# Altium schematic sheet Pan and Tilt Controller.SchDoc
size A4
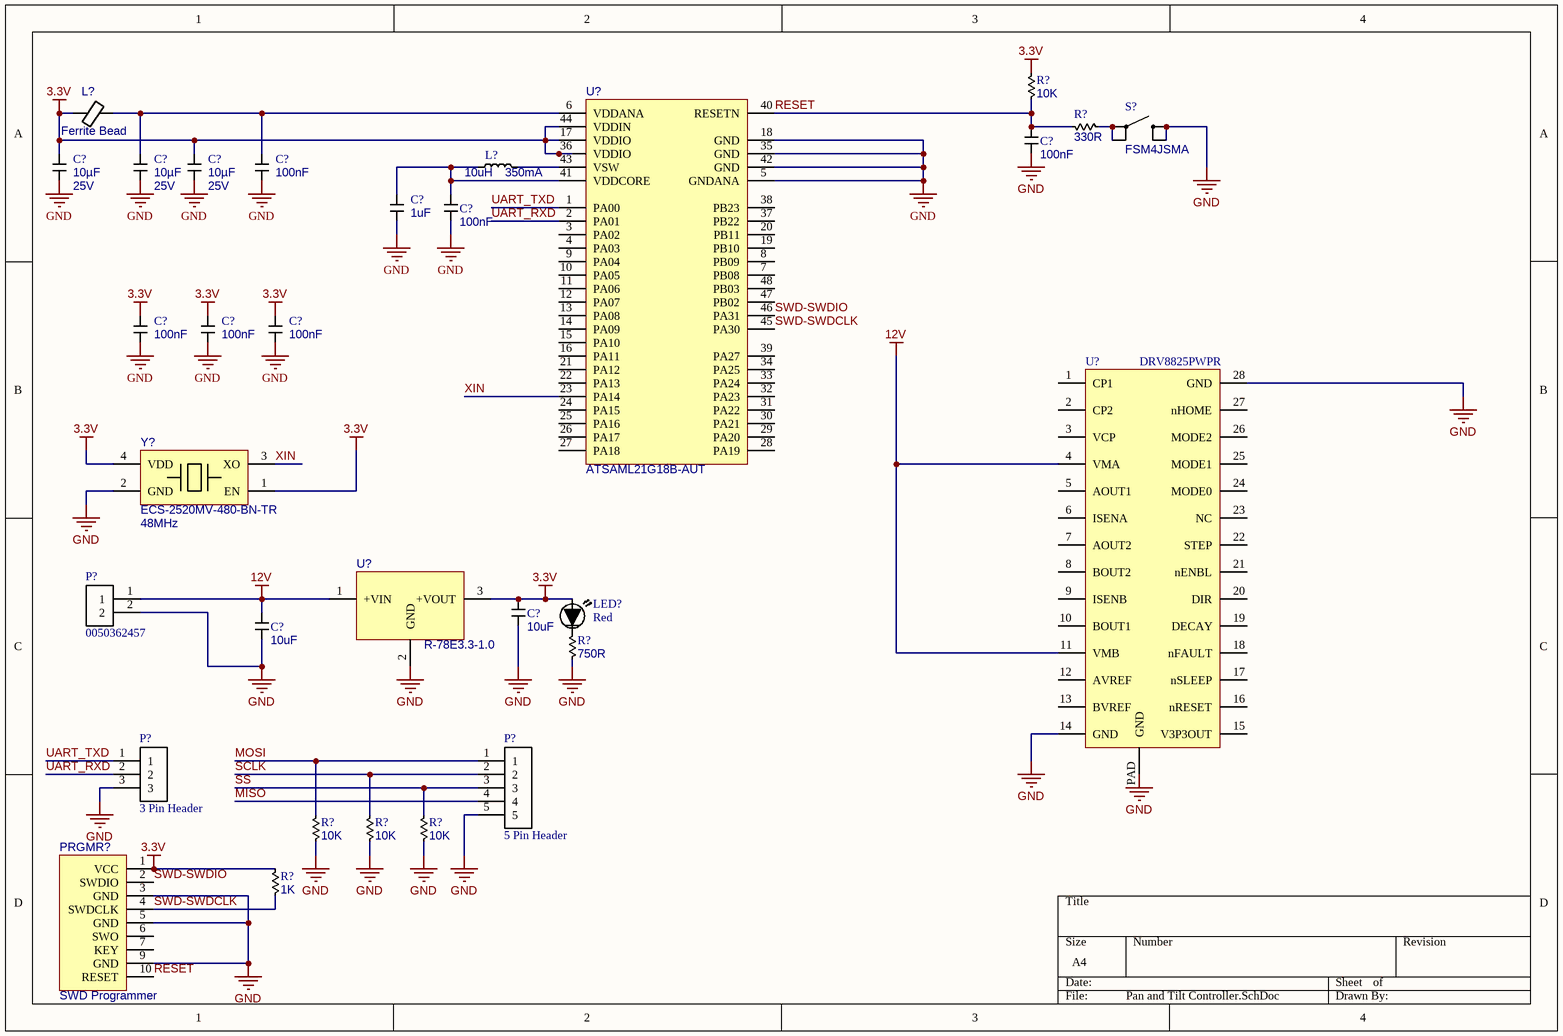
[diagram p0: Pan and Tilt Controller.SchDoc]

## Parts
(Parts that share a designator on the sheet are numbered #1, #2 ... from top to bottom, then left to right.)
C?#1  Capacitance: 100nF  [C0805]  (hidden comment: F)
C?#2  Voltage Rating: 25V  Capacitance: 10µF  [C0805]  (hidden comment: F)
C?#3  Voltage Rating: 25V  Capacitance: 10µF  [C0805]  (hidden comment: F)
C?#4  Voltage Rating: 25V  Capacitance: 10µF  [C0805]  (hidden comment: F)
C?#5  Capacitance: 100nF  [C0805]  (hidden comment: F)
C?#6  Capacitance: 1uF  [C0805]  (hidden comment: F)
C?#7  Capacitance: 100nF  [C0805]  (hidden comment: F)
C?#8  Capacitance: 100nF  [C0805]  (hidden comment: F)
C?#9  Capacitance: 100nF  [C0805]  (hidden comment: F)
C?#10  Capacitance: 100nF  [C0805]  (hidden comment: F)
C?#11  Capacitance: 10uF  [C0805]  (hidden comment: F)
C?#12  Capacitance: 10uF  [C0805]  (hidden comment: F)
L?#1  Ferrite Bead  [0603]
L?#2  Inductance: 10uH  Current Rating: 350mA  [0805]  (hidden comment: H mA)
LED?  Red  [0805LED]
P?#1  0050362457  [MOLEX 0050362457]
P?#2  3 Pin Header  [Header 3 Pin]
P?#3  5 Pin Header  [B5B-XH-A]
PRGMR?  SWD Programmer  [HEADER 5X2]
R?#1  Resistance: 10K  [R0805]  (hidden comment: 330Ω)
R?#2  Resistance: 330R  [R0805]  (hidden comment: 330Ω)
R?#3  Resistance: 750R  [R0805]  (hidden comment: 330Ω)
R?#4  Resistance: 10K  [R0805]  (hidden comment: 330Ω)
R?#5  Resistance: 10K  [R0805]  (hidden comment: 330Ω)
R?#6  Resistance: 10K  [R0805]  (hidden comment: 330Ω)
R?#7  Resistance: 1K  [R0805]  (hidden comment: 330Ω)
S?  Manufacturer Part Number: FSM4JSMA  [TE 4-1437565-1]  (hidden comment: SPST Button)
U?#1  ATSAML21G18B-AUT  [ATSAMD21G18A-AU]
U?#2  DRV8825PWPR  [DRV8825PWPR]
U?#3  R-78E3.3-1.0  [Recom R-78E3.3-1.0]
Y?  ECS-2520MV-480-BN-TR  Frequency: 48MHz  [ECS-2520MV-480-BN-TR]

## Nets
3.3V: C?#2.1 C?#4.1 C?#8.1 C?#9.1 C?#10.1 C?#11.1 L?#1.1 LED?.1 PRGMR?.1(VCC) R?#1.2 R?#7.2 U?#1.17(VDDIO) U?#1.36(VDDIO) U?#1.44(VDDIN) U?#3.3(+VOUT) Y?.1(EN) Y?.4(VDD)
12V: C?#12.1 P?#1.1 U?#2.4(VMA) U?#2.11(VMB) U?#3.1(+VIN)
GND: C?#1.2 C?#2.2 C?#3.2 C?#4.2 C?#5.2 C?#6.2 C?#7.2 C?#8.2 C?#9.2 C?#10.2 C?#11.2 C?#12.2 P?#1.2 P?#2.3 P?#3.5 PRGMR?.3(GND) PRGMR?.5(GND) PRGMR?.9(GND) R?#3.1 R?#4.1 R?#5.1 R?#6.1 S?.3 S?.4 U?#1.5(GNDANA) U?#1.18(GND) U?#1.35(GND) U?#1.42(GND) U?#2.14(GND) U?#2.28(GND) U?#2.PAD(GND) U?#3.2(GND) Y?.2(GND)
MISO: P?#3.4
MOSI: P?#3.1 R?#4.2
RESET: C?#1.1 PRGMR?.10(RESET) R?#1.1 R?#2.1 U?#1.40(RESETN)
SCLK: P?#3.2 R?#5.2
SS: P?#3.3 R?#6.2
SWD-SWDCLK: PRGMR?.4(SWDCLK) R?#7.1 U?#1.45(PA30)
SWD-SWDIO: PRGMR?.2(SWDIO) U?#1.46(PA31)
UART_RXD: P?#2.2 U?#1.2(PA01)
UART_TXD: P?#2.1 U?#1.1(PA00)
XIN: U?#1.23(PA14) Y?.3(XO)
NetC?#3_1: C?#3.1 C?#5.1 L?#1.2 U?#1.6(VDDANA)
NetC?#6_1: C?#6.1 C?#7.1 L?#2.2 U?#1.41(VDDCORE)
NetL?#2_1: L?#2.1 U?#1.43(VSW)
NetLED?_2: LED?.2 R?#3.2
NetR?#2_2: R?#2.2 S?.1 S?.2

Not connected (* = marked no-connect by the designer): PRGMR? 6(SWO) 7(KEY); U?#1 3(PA02) 4(PA03) 7(PB08) 8(PB09) 9(PA04) 10(PA05) 11(PA06) 12(PA07) 13(PA08) 14(PA09) 15(PA10) 16(PA11) 19(PB10) 20(PB11) 21(PA12) 22(PA13) 24(PA15) 25(PA16) 26(PA17) 27(PA18) 28(PA19) 29(PA20) 30(PA21) 31(PA22) 32(PA23) 33(PA24) 34(PA25) 37(PB22) 38(PB23) 39(PA27) 47(PB02) 48(PB03); U?#2 1(CP1) 2(CP2) 3(VCP) 5(AOUT1) 6(ISENA) 7(AOUT2) 8(BOUT2) 9(ISENB) 10(BOUT1) 12(AVREF) 13(BVREF) 15(V3P3OUT) 16(nRESET) 17(nSLEEP) 18(nFAULT) 19(DECAY) 20(DIR) 21(nENBL) 22(STEP) 23(NC) 24(MODE0) 25(MODE1) 26(MODE2) 27(nHOME)

## Library data of the parts
C?#1 C?#5 C?#7-C?#10 = Capacitor: Manufacturer: Samsung Electro-Mechanics; Manufacturer Part Number: CL21B104KBCNNNC; Voltage Rating: 50V; Supplier: Digi-Key Electronics; Supplier Part Number: 1276-1003-1-ND; Price: 0.16
C?#2-C?#4 = Capacitor: Manufacturer: Samsung Electro-Mechanics; Manufacturer Part Number: CL21A106KAYNNNG; Supplier: Digi-Key Electronics; Supplier Part Number: 1276-6454-1-ND; Price: 0.28
C?#6 = Capacitor: Manufacturer: Samsung Electro-Mechanics; Manufacturer Part Number: CL21B105KAFNNNE; Voltage Rating: 25V; Supplier: Digi-Key Electronics; Supplier Part Number: 1276-1066-1-ND; Price: 0.16
C?#11 = Capacitor: Manufacturer: Samsung Electro-Mechanics; Manufacturer Part Number: CL21B106KQQNNNE; Voltage Rating: 6.3; Supplier: Digi-Key Electronics; Supplier Part Number: 1276-1113-1-ND; Price: 0.03
C?#12 = Capacitor: Manufacturer: Samsung Electro-Mechanics; Manufacturer Part Number: 1276-1096-1-ND; Voltage Rating: 16V; Supplier: Digi-Key Electronics; Supplier Part Number: 1276-1096-1-ND; Price: 0.03
L?#2 = Inductor: Manufacturer: TDK Corporation; Manufacturer Part Number: MLZ2012M100WT000; Shielding: Yes; Tolerance: ±20%; DC Resistance: 470mOhm; Supplier Part Number: 445-6396-1-ND; Supplier: Digi-Key Electronics; Operating Temperature: -55°C ~ 125°C; Price: 0.20
LED? = LED: Light Emitting Diode; Manufacturer: Rohm Semiconductor; Manufacturer Part Number: SML-211UTT86; Forward Current: 2mA; Forward Voltage: 1.8V; Supplier: Digi-Key Electronics; Colour: Red; Supplier Part Number: SML-211UTT86
P?#1 = Header 2: 2 Pin Header; Manufacturer: Molex; Current Rating: 9A; Supplier: Digi-Key Electronics; Supplier Part Number: WM19570-ND; Manufacturer Part Number: 0050362457
P?#2 = Header 3
P?#3 = Header 5
PRGMR? = SWD Programmer: Atmel ICE Programmer
R?#1 R?#4-R?#6 = Resistor: Standard Resistor; Manufacturer: YAGEO; Manufacturer Part Number: RC0805JR-0710KL; Power Rating: 1/8W; Supplier: Digi-Key Electronics; Supplier Part Number: 311-10KARCT-ND; Price: 0.16
R?#2 = Resistor: Standard Resistor; Manufacturer: YAGEO; Manufacturer Part Number: RC0805FR-13330RL; Power Rating: 1/8W; Supplier: Digi-Key Electronics; Supplier Part Number: 13-RC0805FR-13330RLCT-ND; Price: 0.16
R?#3 = Resistor: Standard Resistor; Manufacturer: YAGEO; Manufacturer Part Number: RC0805JR-07750RL; Power Rating: 1/8W; Supplier: Digi-Key Electronics; Supplier Part Number: 311-750ARCT-ND; Price: 0.16
R?#7 = Resistor: Standard Resistor; Manufacturer: Stackpole Electronics Inc; Manufacturer Part Number: RNCP0805FTD1K00; Power Rating: 0.25W; Supplier: Digi-Key Electronics; Supplier Part Number: RNCP0805FTD1K00CT-ND; Price: 0.16
S? = SPST Button: Manufacturer: TE Connectivity ALCOSWITCH Switches; Voltage Rating: 24V; Current Rating: 50mA; Supplier: Digi-Key Electronics; Supplier Part Number: 450-1129-ND
U?#1 = ATSAML21G18B-AUT: 32-Bit Microcontroller, 48MHz, 256kB
U?#2 = DRV8825PWPR: Bipolar Motor Driver Power MOSFET Logic 28-HTSSOP; Manufacturer: Texas Instruments; Manufacturer Part Number: DRV8825PWPR; Supplier: Digi-Key Electronics; Supplier Part Number: 296-29503-1-ND
U?#3 = RECOM R-78E3.3-1.0: Linear Regulator Replacement DC DC Converter 1 Output 3.3V 1A 7V - 28V Input; Manufacturer: RECOM Power; Input Voltage Range: 7-28V; Supplier: Digi-Key Electronics; Manufacturer Part Number: R-78E3.3-1.0; Supplier Part Number: 945-2409-5-ND; Output Voltage: 3.3V; Output Current: 1A
Y? = ECS-2520MV-480-BN-TR: 48 MHz XO (Standard) HCMOS Oscillator 1.6V ~ 3.6V Enable/Disable 4-SMD, No Lead; Manufacturer: ECS Inc.; Frequency Stability: ±50ppm; Supplier: Digi-Key Electronics; Supplier Part Number: XC2756CT-ND; Manufacturer Part Number: ECS-2520MV-480-BN-TR